# Altium schematic sheet AD_info.SchDoc
size A4; DocumentNumber: 1; SheetNumber: 1; SheetTotal: 4
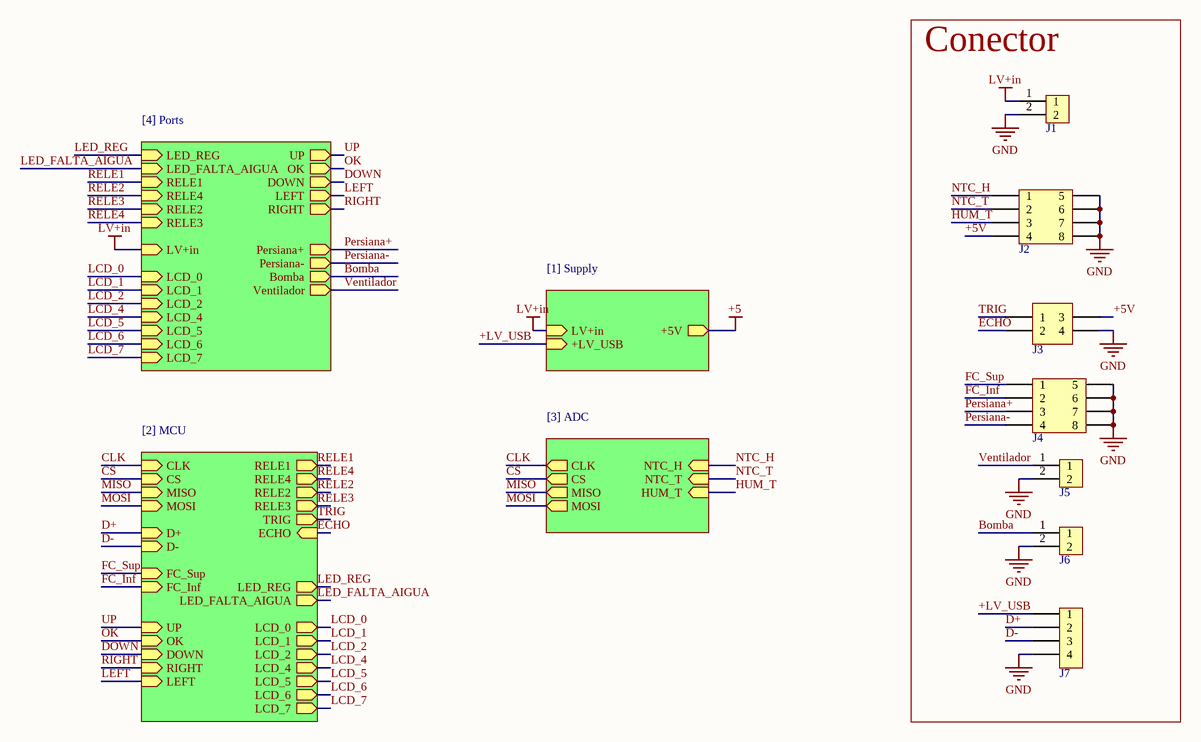
[diagram p0: AD_info.SchDoc]

## Parts
J1  436500215  [J_MicroFit_2x1]  (value not drawn)
J2  105314-1108  [J_NanoFit_2X4]  (value not drawn)
J3  J_NanoFit_2x2  [J_NanoFit_2x2_v]  (value not drawn)
J4  105314-1108  [J_NanoFit_2X4]  (value not drawn)
J5  436500215  [J_MicroFit_2x1]  (value not drawn)
J6  436500215  [J_MicroFit_2x1]  (value not drawn)
J7  61300411121  [J_PinHeader_1x4]  (value not drawn)

## Blocks framed on the sheet
Conector: J1-J7

## Sub-sheets
[1] Supply = [1] Supply: LV+in (in), +5V (out), +LV_USB (in)
[2] MCU = [2] MCU: CLK (in), CS (in), MISO (in), MOSI (in), D+ (in), D- (in), TRIG (out), ECHO (in), FC_Sup (in), FC_Inf (in), RELE1 (out), RELE4 (out), RELE2 (out), RELE3 (out), UP (in), OK (in), DOWN (in), LEFT (in), RIGHT (in), LED_REG (out), LED_FALTA_AIGUA (out), LCD_0 (out), LCD_1 (out), LCD_2 (out), LCD_4 (out), LCD_5 (out), LCD_6 (out), LCD_7 (out)
[3] ADC = [3] ADC: CLK (out), CS (out), MISO (out), MOSI (out), NTC_H (in), NTC_T (in), HUM_T (in)
[4] Ports = [4] Ports: UP (out), OK (out), DOWN (out), LEFT (out), RIGHT (out), LED_REG (in), LED_FALTA_AIGUA (in), RELE1 (in), RELE4 (in), RELE2 (in), RELE3 (in), Persiana+ (out), Bomba (out), Persiana- (out), Ventilador (out), LV+in (in), LCD_0 (in), LCD_1 (in), LCD_2 (in), LCD_4 (in), LCD_5 (in), LCD_6 (in), LCD_7 (in)

## Nets
+5: sheet [1] Supply/+5V
GND: J1.2 J2.5 J2.6 J2.7 J2.8 J3.4 J4.5 J4.6 J4.7 J4.8 J5.2 J6.2 J7.4
LV+in: J1.1 ; sheet [1] Supply/LV+in, sheet [4] Ports/LV+in
+5V: J2.4 J3.3
+LV_USB: J7.1 ; sheet [1] Supply/+LV_USB
Bomba: J6.1 ; sheet [4] Ports/Bomba
CLK: sheet [2] MCU/CLK, sheet [3] ADC/CLK
CS: sheet [2] MCU/CS, sheet [3] ADC/CS
D+: J7.2 ; sheet [2] MCU/D+
D-: J7.3 ; sheet [2] MCU/D-
DOWN: sheet [2] MCU/DOWN, sheet [4] Ports/DOWN
ECHO: J3.2 ; sheet [2] MCU/ECHO
FC_Inf: J4.2 ; sheet [2] MCU/FC_Inf
FC_Sup: J4.1 ; sheet [2] MCU/FC_Sup
HUM_T: J2.3 ; sheet [3] ADC/HUM_T
LCD_0: sheet [2] MCU/LCD_0, sheet [4] Ports/LCD_0
LCD_1: sheet [2] MCU/LCD_1, sheet [4] Ports/LCD_1
LCD_2: sheet [2] MCU/LCD_2, sheet [4] Ports/LCD_2
LCD_4: sheet [2] MCU/LCD_4, sheet [4] Ports/LCD_4
LCD_5: sheet [2] MCU/LCD_5, sheet [4] Ports/LCD_5
LCD_6: sheet [2] MCU/LCD_6, sheet [4] Ports/LCD_6
LCD_7: sheet [2] MCU/LCD_7, sheet [4] Ports/LCD_7
LED_FALTA_AIGUA: sheet [2] MCU/LED_FALTA_AIGUA, sheet [4] Ports/LED_FALTA_AIGUA
LED_REG: sheet [2] MCU/LED_REG, sheet [4] Ports/LED_REG
LEFT: sheet [2] MCU/LEFT, sheet [4] Ports/LEFT
MISO: sheet [2] MCU/MISO, sheet [3] ADC/MISO
MOSI: sheet [2] MCU/MOSI, sheet [3] ADC/MOSI
NTC_H: J2.1 ; sheet [3] ADC/NTC_H
NTC_T: J2.2 ; sheet [3] ADC/NTC_T
OK: sheet [2] MCU/OK, sheet [4] Ports/OK
Persiana+: J4.3 ; sheet [4] Ports/Persiana+
Persiana-: J4.4 ; sheet [4] Ports/Persiana-
RELE1: sheet [2] MCU/RELE1, sheet [4] Ports/RELE1
RELE2: sheet [2] MCU/RELE2, sheet [4] Ports/RELE4
RELE3: sheet [2] MCU/RELE3, sheet [4] Ports/RELE2
RELE4: sheet [2] MCU/RELE4, sheet [4] Ports/RELE3
RIGHT: sheet [2] MCU/RIGHT, sheet [4] Ports/RIGHT
TRIG: J3.1 ; sheet [2] MCU/TRIG
UP: sheet [2] MCU/UP, sheet [4] Ports/UP
Ventilador: J5.1 ; sheet [4] Ports/Ventilador

## Library data of the parts
J1 J5 J6 = J_MicroFit_2x1: Header 1 Row Vertical Polarizing Peg 2 Pin SMT/Glow Wire Compatible Tin Plate; Manufacturer 1: Molex; Manufacturer Part Number 1: 43650-0215; Supplier 1: Arrow Electronics; RoHS: Yes; Category: Headers and Wire Housings; Stock 1: 11086; Pricing 1: 1=0,87800, 10=0,74400, 80=0,63070, 3264=0,47000, 6528=0,45100, 13056=0,41760 (USD); ComponentLink1URL: https://datasheet.ciiva.com/19462/884109-19462034.pdf?src-supplier=Jameco; ComponentLink1Description: https://datasheet.ciiva.com/19462/884109-19462034.pdf?src-supplier=Jameco; ComponentLink2URL: https://datasheet.ciiva.com/5157/0436500215-pcb-headers-148687-5157608.pdf?src-supplier=Mouser; ComponentLink2Description: https://datasheet.ciiva.com/5157/0436500215-pcb-headers-148687-5157608.pdf?src-supplier=Mouser; ComponentLink3URL: https://datasheet.ciiva.com/16085/0436500215-pcb-headers-16085668.pdf?src-supplier=Onlinecomponents.com; ComponentLink3Description: https://datasheet.ciiva.com/16085/0436500215-pcb-headers-16085668.pdf?src-supplier=Onlinecomponents.com; ComponentLink4URL: https://datasheet.ciiva.com/11748/0900766b80307ce2-11748388.pdf?src-supplier=RSComponents; ComponentLink4Description: https://datasheet.ciiva.com/11748/0900766b80307ce2-11748388.pdf?src-supplier=RSComponents; ComponentLink5URL: https://datasheet.ciiva.com/9432/0436500215-pcb-headers-9432850.pdf?src-supplier=Avnet; ComponentLink5Description: https://datasheet.ciiva.com/9432/0436500215-pcb-headers-9432850.pdf?src-supplier=Avnet; ComponentLink6URL: https://datasheet.ciiva.com/7920/1889390-7920892.pdf?src-supplier=Element14; ComponentLink6Description: https://datasheet.ciiva.com/7920/1889390-7920892.pdf?src-supplier=Element14; Supplier Part Number 1: 43650-0215
J2 J4 = J_NanoFit_2x4: Nano-Fit Right Angle Header Through Hole 2.50mm Pitch Dual Row 8 Circuits Tin (Sn) Plating Black; Manufacturer: Molex; Temperature rating: -40° to +105°C; Category type: PCB header; Maximum current: 7.5 A; Maximum voltage: 750 V AC; Connections: 2x4; Connector Type: Header,Male Pin; Number of Positions: 8; .Creator: DO; Category: Connector; ComponentLink1Description: Datasheet; ComponentLink1URL: https://www.molex.com/molex/products/part-detail/pcb_headers/1053141104; ComponentLink2Description: Where buy it; ComponentLink2URL: *; Manufacturer part number: 105314-1108; Supplier: *; RoHS: *; Application: Wire to board; Product name: Nano-Fit; Flammability: 94V-0; Orientation: Right Angle; Mount: Through hole; Supplier 1: Digi-Key; Stock 1: 11021; Pricing 1: 1=1,98000, 10=1,68600, 156=1,39308, 1092=1,09983, 4992=0,97518, 10140=0,95318 (USD); Contact Plating: Tin; Contact Material: Brass; Contact Shape: Square; Insulation Material: Polymer; Insulation Color: Black; Min Operating Temperature: -40°C; Max Operating Temperature: 105°C; Fastening Type: Latch; Packaging: Tray; Number of Rows: 2; Termination: Solder; RoHS Compliant: Yes; ComponentLink3URL: http://www.farnell.com/datasheets/2551096.pdf?src-supplier=Newark; ComponentLink3Description: http://www.farnell.com/datasheets/2551096.pdf?src-supplier=Newark; ComponentLink4URL: https://www.molex.com/pdm_docs/sd/1053141104_sd.pdf?src-supplier=Digi-Key; ComponentLink4Description: https://www.molex.com/pdm_docs/sd/1053141104_sd.pdf?src-supplier=Digi-Key; Supplier Part Number 1: WM16909-ND
J3 = J_NanoFit_2x2: Conn Nano-Fit Power HDR 4 POS 2.5mm Solder ST Through Hole 4 Terminal Single Port Tray; Manufacturer 1: Molex; Manufacturer Part Number 1: 1053101104; Supplier 1: Farnell; RoHS: Yes; Category: Uncategorized; Stock 1: 255; Pricing 1: 1=1,43000, 10=1,18000, 50=0,74900, 100=0,72900, 500=0,71400, 1000=0,70700 (EUR); ComponentLink1URL: https://www.molex.com/pdm_docs/ps/PS-105300-100-001.pdf?src-supplier=Digi-Key; ComponentLink1Description: https://www.molex.com/pdm_docs/ps/PS-105300-100-001.pdf?src-supplier=Digi-Key; Supplier Part Number 1: 2820681
J7 = J_UART: CONN HEADER 4 POS 2.54; Manufacturer 1: Wurth Electronics; Number of Positions: 4; Gender: Male; Connector Type: Male Pin; Pitch: 0.1inch; .Creator: AC; Supplier 1: RSComponents; Manufacturer Part Number 1: 61300411121; RoHS: Yes; Category: Headers and Wire Housings; Stock 1: 1; Pricing 1: 5=0,19500, 250=0,08000, 500=0,07700, 2500=0,07500, 5000=0,07200 (USD); Mount: Through Hole; Contact Plating: Gold; Contact Material: Copper; Color: Black; Number of Rows: 1; Packaging: Bulk; Termination: Solder; Number of Contacts: 4; Contact Mating Length: 0.236inch; REACH SVHC: Unknown; Lead Free: Lead Free; RoHS Compliant: Yes; ComponentLink1URL: http://www.farnell.com/cad/1737268.pdf?src-supplier=Element14; ComponentLink1Description: http://www.farnell.com/cad/1737268.pdf?src-supplier=Element14; ComponentLink2URL: https://katalog.we-online.de/em/datasheet/6130xx11121.pdf?src-supplier=Digi-Key; ComponentLink2Description: https://katalog.we-online.de/em/datasheet/6130xx11121.pdf?src-supplier=Digi-Key; Supplier Part Number 1: 8281594